# Altium schematic sheet Charge_station.SchDoc
size 594 x 420 mm; SheetNumber: 1; SheetTotal: 1
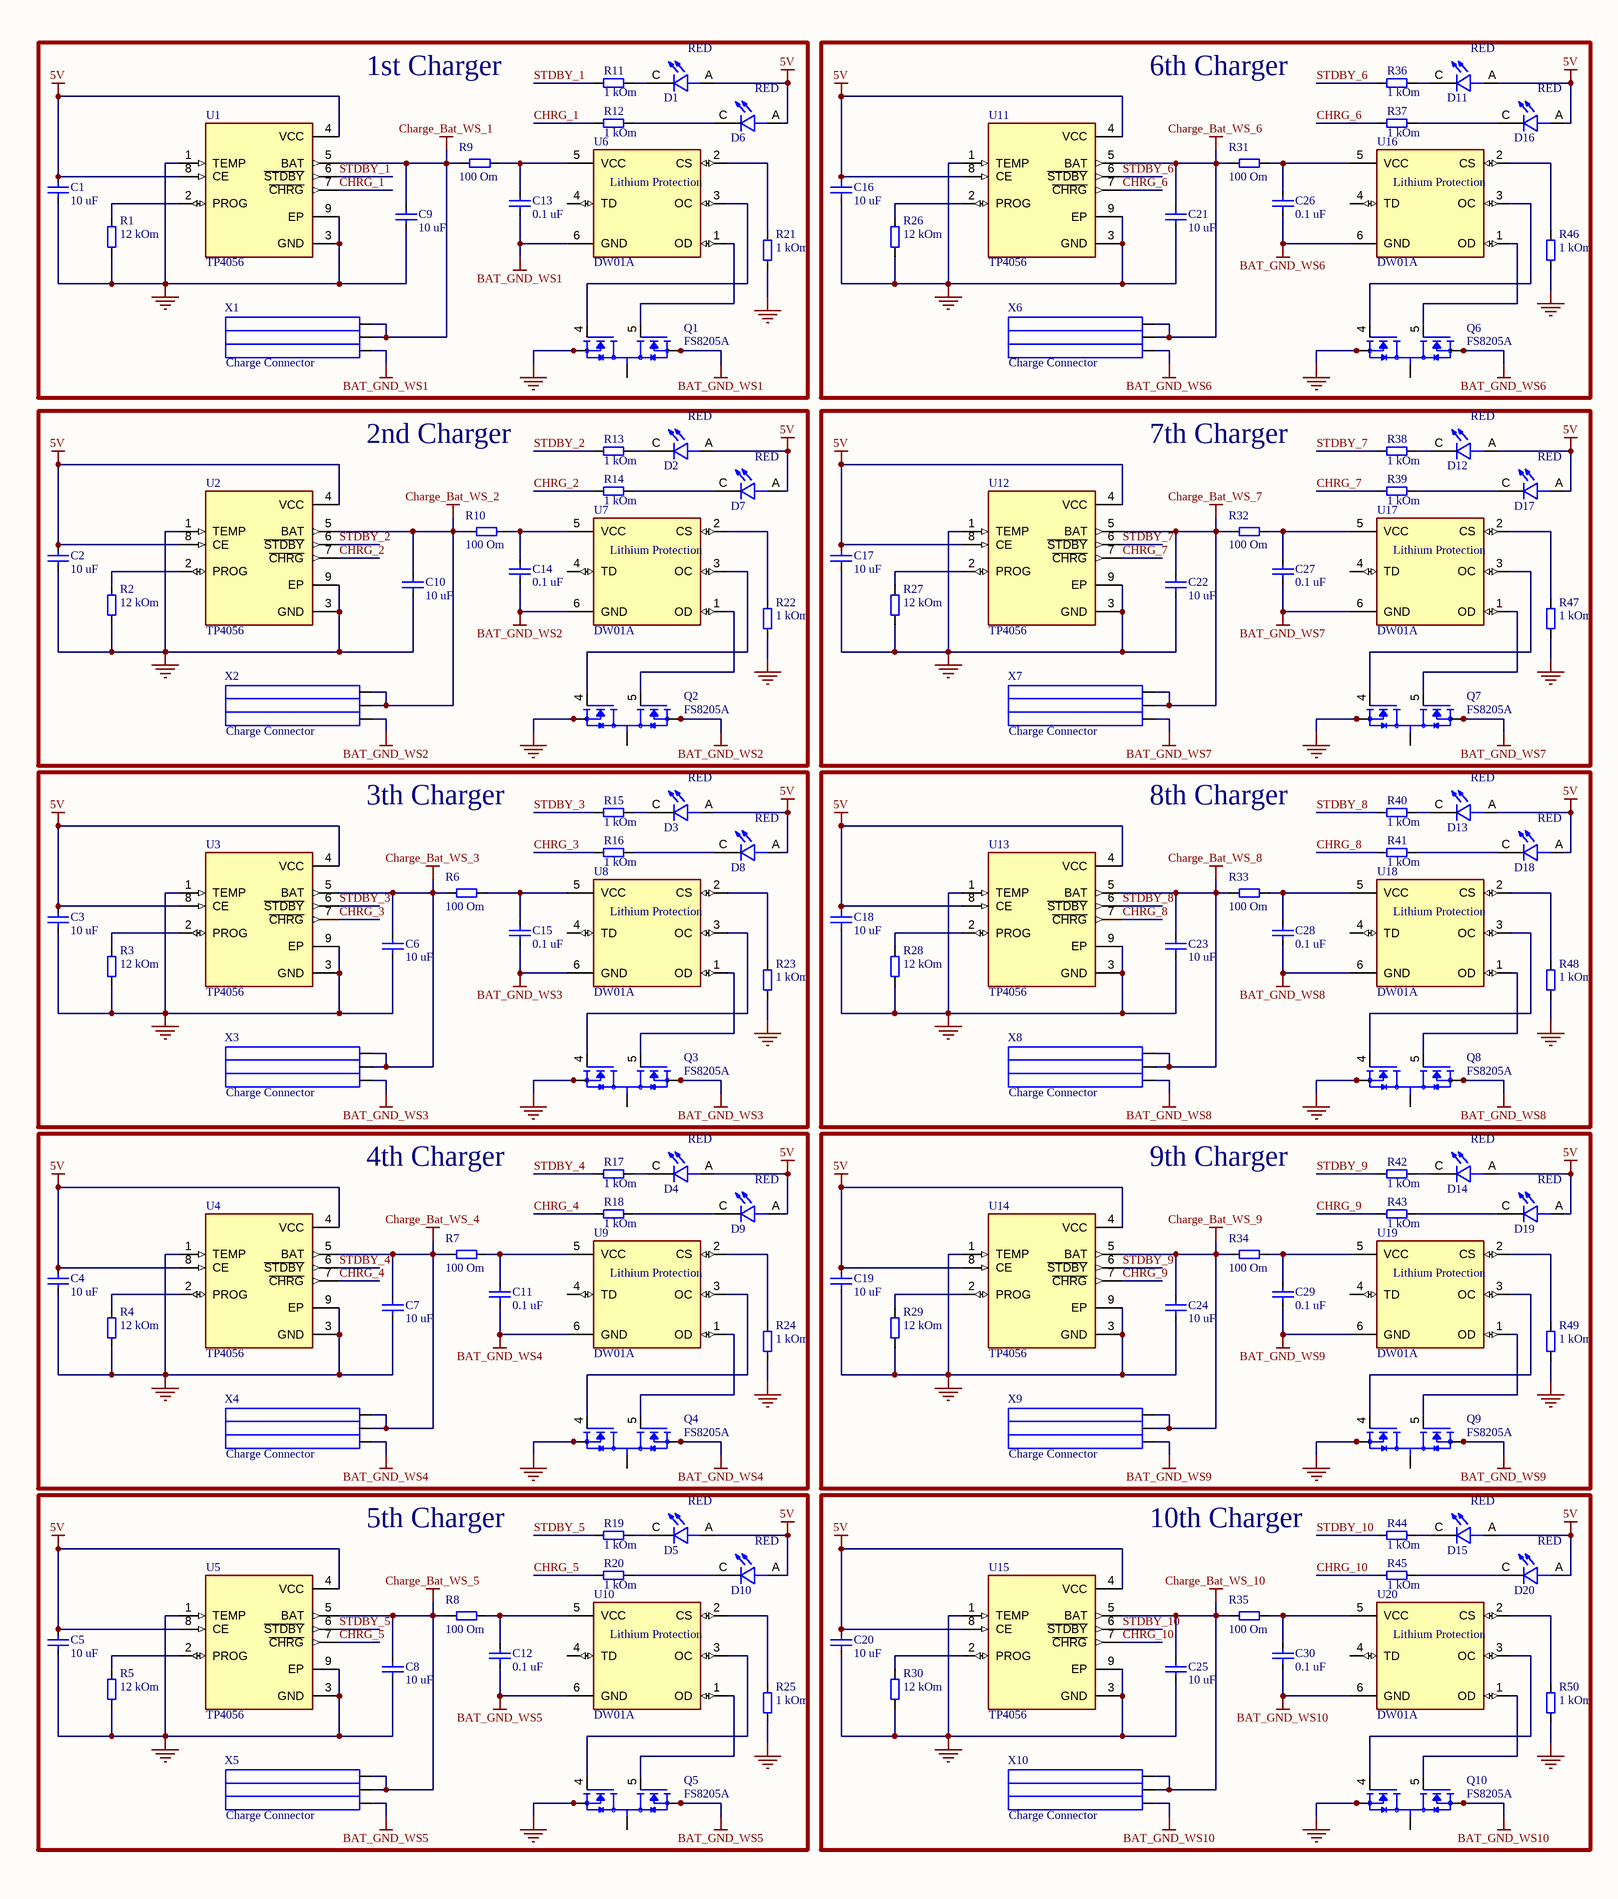
[diagram p0: Charge_station.SchDoc, left]
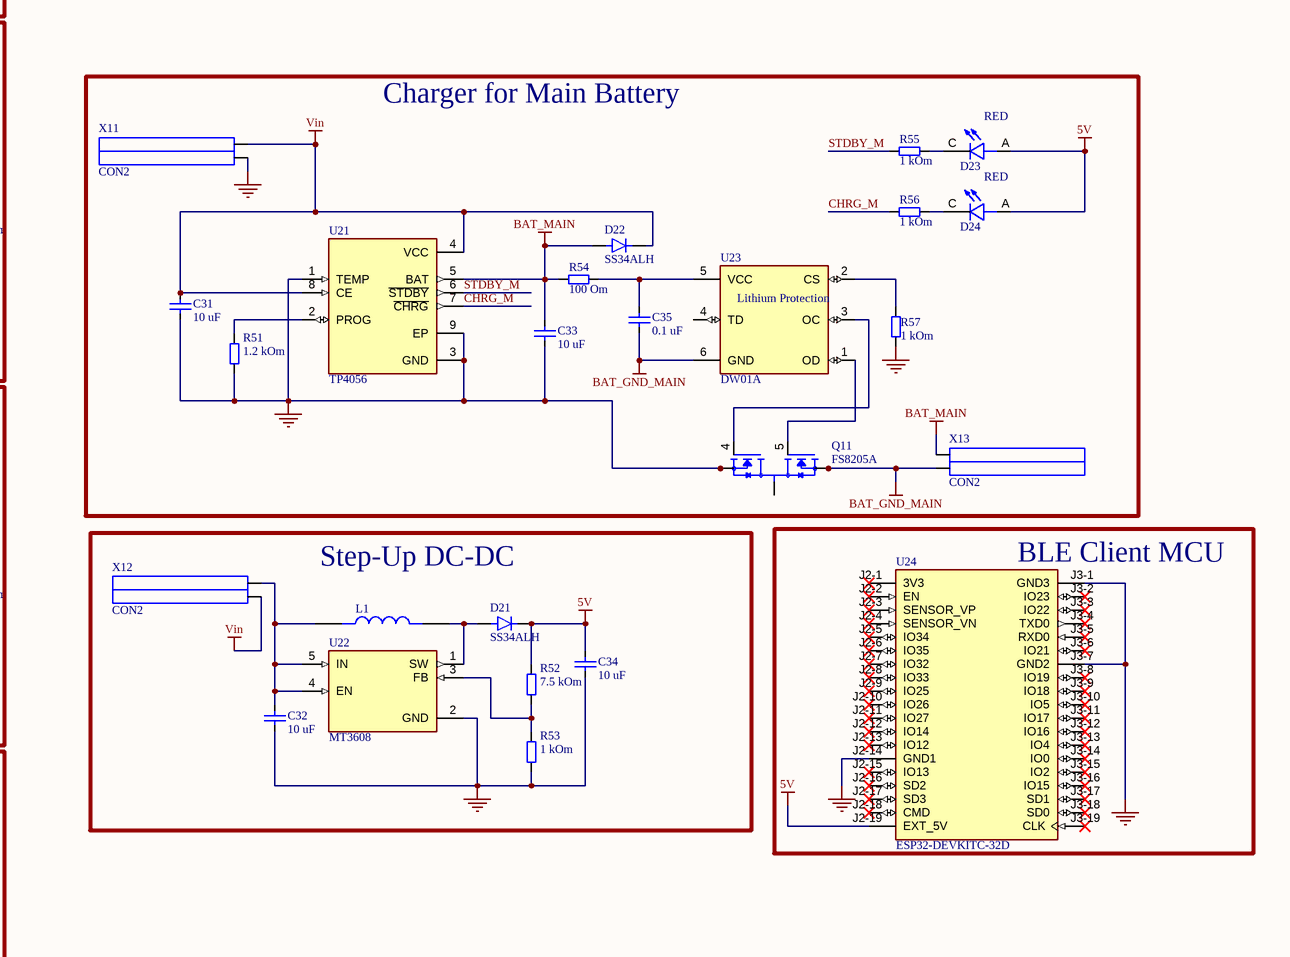
[diagram p1: Charge_station.SchDoc, right]

## Parts
C1  value 10 uF  [CAPC1608X90N]  (hidden comment: STD_CAP)
C2  value 10 uF  [CAPC1608X90N]  (hidden comment: STD_CAP)
C3  value 10 uF  [CAPC1608X90N]  (hidden comment: STD_CAP)
C4  value 10 uF  [CAPC1608X90N]  (hidden comment: STD_CAP)
C5  value 10 uF  [CAPC1608X90N]  (hidden comment: STD_CAP)
C6  value 10 uF  [CAPC1608X90N]  (hidden comment: STD_CAP)
C7  value 10 uF  [CAPC1608X90N]  (hidden comment: STD_CAP)
C8  value 10 uF  [CAPC1608X90N]  (hidden comment: STD_CAP)
C9  value 10 uF  [CAPC1608X90N]  (hidden comment: STD_CAP)
C10  value 10 uF  [CAPC1608X90N]  (hidden comment: STD_CAP)
C11  value 0.1 uF  [CAPC1608X90N]  (hidden comment: STD_CAP)
C12  value 0.1 uF  [CAPC1608X90N]  (hidden comment: STD_CAP)
C13  value 0.1 uF  [CAPC1608X90N]  (hidden comment: STD_CAP)
C14  value 0.1 uF  [CAPC1608X90N]  (hidden comment: STD_CAP)
C15  value 0.1 uF  [CAPC1608X90N]  (hidden comment: STD_CAP)
C16  value 10 uF  [CAPC1608X90N]  (hidden comment: STD_CAP)
C17  value 10 uF  [CAPC1608X90N]  (hidden comment: STD_CAP)
C18  value 10 uF  [CAPC1608X90N]  (hidden comment: STD_CAP)
C19  value 10 uF  [CAPC1608X90N]  (hidden comment: STD_CAP)
C20  value 10 uF  [CAPC1608X90N]  (hidden comment: STD_CAP)
C21  value 10 uF  [CAPC1608X90N]  (hidden comment: STD_CAP)
C22  value 10 uF  [CAPC1608X90N]  (hidden comment: STD_CAP)
C23  value 10 uF  [CAPC1608X90N]  (hidden comment: STD_CAP)
C24  value 10 uF  [CAPC1608X90N]  (hidden comment: STD_CAP)
C25  value 10 uF  [CAPC1608X90N]  (hidden comment: STD_CAP)
C26  value 0.1 uF  [CAPC1608X90N]  (hidden comment: STD_CAP)
C27  value 0.1 uF  [CAPC1608X90N]  (hidden comment: STD_CAP)
C28  value 0.1 uF  [CAPC1608X90N]  (hidden comment: STD_CAP)
C29  value 0.1 uF  [CAPC1608X90N]  (hidden comment: STD_CAP)
C30  value 0.1 uF  [CAPC1608X90N]  (hidden comment: STD_CAP)
C31  value 10 uF  [CAPC1608X90N]  (hidden comment: STD_CAP)
C32  value 10 uF  [CAPC2012X120N]  (hidden comment: STD_CAP)
C33  value 10 uF  [CAPC1608X90N]  (hidden comment: STD_CAP)
C34  value 10 uF  [CAPC2012X120N]  (hidden comment: STD_CAP)
C35  value 0.1 uF  [CAPC1608X90N]  (hidden comment: STD_CAP)
D1  7012X1  [LED_KPT-1608ZGC]  (value not drawn)
D2  7012X1  [LED_KPT-1608ZGC]  (value not drawn)
D3  7012X1  [LED_KPT-1608ZGC]  (value not drawn)
D4  7012X1  [LED_KPT-1608ZGC]  (value not drawn)
D5  7012X1  [LED_KPT-1608ZGC]  (value not drawn)
D6  7012X1  [LED_KPT-1608ZGC]  (value not drawn)
D7  7012X1  [LED_KPT-1608ZGC]  (value not drawn)
D8  7012X1  [LED_KPT-1608ZGC]  (value not drawn)
D9  7012X1  [LED_KPT-1608ZGC]  (value not drawn)
D10  7012X1  [LED_KPT-1608ZGC]  (value not drawn)
D11  7012X1  [LED_KPT-1608ZGC]  (value not drawn)
D12  7012X1  [LED_KPT-1608ZGC]  (value not drawn)
D13  7012X1  [LED_KPT-1608ZGC]  (value not drawn)
D14  7012X1  [LED_KPT-1608ZGC]  (value not drawn)
D15  7012X1  [LED_KPT-1608ZGC]  (value not drawn)
D16  7012X1  [LED_KPT-1608ZGC]  (value not drawn)
D17  7012X1  [LED_KPT-1608ZGC]  (value not drawn)
D18  7012X1  [LED_KPT-1608ZGC]  (value not drawn)
D19  7012X1  [LED_KPT-1608ZGC]  (value not drawn)
D20  7012X1  [LED_KPT-1608ZGC]  (value not drawn)
D21  SS34ALH  [SODFL5226X100N]
D22  SS34ALH  [SODFL5226X100N]
D23  7012X1  [LED_KPT-1608ZGC]  (value not drawn)
D24  7012X1  [LED_KPT-1608ZGC]  (value not drawn)
L1  B82464G4223M000  [IND_B82464G4223M000]  (value not drawn)
Q1  FS8205A  [SOP65P640X120-8N]
Q2  FS8205A  [SOP65P640X120-8N]
Q3  FS8205A  [SOP65P640X120-8N]
Q4  FS8205A  [SOP65P640X120-8N]
Q5  FS8205A  [SOP65P640X120-8N]
Q6  FS8205A  [SOP65P640X120-8N]
Q7  FS8205A  [SOP65P640X120-8N]
Q8  FS8205A  [SOP65P640X120-8N]
Q9  FS8205A  [SOP65P640X120-8N]
Q10  FS8205A  [SOP65P640X120-8N]
Q11  FS8205A  [SOP65P640X120-8N]
R1  value 12 kOm  [RESC1608X50AN]  (hidden comment: STD_RES)
R2  value 12 kOm  [RESC1608X50AN]  (hidden comment: STD_RES)
R3  value 12 kOm  [RESC1608X50AN]  (hidden comment: STD_RES)
R4  value 12 kOm  [RESC1608X50AN]  (hidden comment: STD_RES)
R5  value 12 kOm  [RESC1608X50AN]  (hidden comment: STD_RES)
R6  value 100 Om  [RESC1608X50AN]  (hidden comment: STD_RES)
R7  value 100 Om  [RESC1608X50AN]  (hidden comment: STD_RES)
R8  value 100 Om  [RESC1608X50AN]  (hidden comment: STD_RES)
R9  value 100 Om  [RESC1608X50AN]  (hidden comment: STD_RES)
R10  value 100 Om  [RESC1608X50AN]  (hidden comment: STD_RES)
R11  value 1 kOm  [R0603]  (hidden comment: STD_RES)
R12  value 1 kOm  [R0603]  (hidden comment: STD_RES)
R13  value 1 kOm  [R0603]  (hidden comment: STD_RES)
R14  value 1 kOm  [R0603]  (hidden comment: STD_RES)
R15  value 1 kOm  [R0603]  (hidden comment: STD_RES)
R16  value 1 kOm  [R0603]  (hidden comment: STD_RES)
R17  value 1 kOm  [R0603]  (hidden comment: STD_RES)
R18  value 1 kOm  [R0603]  (hidden comment: STD_RES)
R19  value 1 kOm  [R0603]  (hidden comment: STD_RES)
R20  value 1 kOm  [R0603]  (hidden comment: STD_RES)
R21  value 1 kOm  [RESC1608X50AN]  (hidden comment: STD_RES)
R22  value 1 kOm  [RESC1608X50AN]  (hidden comment: STD_RES)
R23  value 1 kOm  [RESC1608X50AN]  (hidden comment: STD_RES)
R24  value 1 kOm  [RESC1608X50AN]  (hidden comment: STD_RES)
R25  value 1 kOm  [RESC1608X50AN]  (hidden comment: STD_RES)
R26  value 12 kOm  [RESC1608X50AN]  (hidden comment: STD_RES)
R27  value 12 kOm  [RESC1608X50AN]  (hidden comment: STD_RES)
R28  value 12 kOm  [RESC1608X50AN]  (hidden comment: STD_RES)
R29  value 12 kOm  [RESC1608X50AN]  (hidden comment: STD_RES)
R30  value 12 kOm  [RESC1608X50AN]  (hidden comment: STD_RES)
R31  value 100 Om  [RESC1608X50AN]  (hidden comment: STD_RES)
R32  value 100 Om  [RESC1608X50AN]  (hidden comment: STD_RES)
R33  value 100 Om  [RESC1608X50AN]  (hidden comment: STD_RES)
R34  value 100 Om  [RESC1608X50AN]  (hidden comment: STD_RES)
R35  value 100 Om  [RESC1608X50AN]  (hidden comment: STD_RES)
R36  value 1 kOm  [R0603]  (hidden comment: STD_RES)
R37  value 1 kOm  [R0603]  (hidden comment: STD_RES)
R38  value 1 kOm  [R0603]  (hidden comment: STD_RES)
R39  value 1 kOm  [R0603]  (hidden comment: STD_RES)
R40  value 1 kOm  [R0603]  (hidden comment: STD_RES)
R41  value 1 kOm  [R0603]  (hidden comment: STD_RES)
R42  value 1 kOm  [R0603]  (hidden comment: STD_RES)
R43  value 1 kOm  [R0603]  (hidden comment: STD_RES)
R44  value 1 kOm  [R0603]  (hidden comment: STD_RES)
R45  value 1 kOm  [R0603]  (hidden comment: STD_RES)
R46  value 1 kOm  [RESC1608X50AN]  (hidden comment: STD_RES)
R47  value 1 kOm  [RESC1608X50AN]  (hidden comment: STD_RES)
R48  value 1 kOm  [RESC1608X50AN]  (hidden comment: STD_RES)
R49  value 1 kOm  [RESC1608X50AN]  (hidden comment: STD_RES)
R50  value 1 kOm  [RESC1608X50AN]  (hidden comment: STD_RES)
R51  value 1.2 kOm  [RESC1608X50AN]  (hidden comment: STD_RES)
R52  value 7.5 kOm  [RESC1608X50AN]  (hidden comment: STD_RES)
R53  value 1 kOm  [RESC1608X50AN]  (hidden comment: STD_RES)
R54  value 100 Om  [RESC1608X50AN]  (hidden comment: STD_RES)
R55  value 1 kOm  [R0603]  (hidden comment: STD_RES)
R56  value 1 kOm  [R0603]  (hidden comment: STD_RES)
R57  value 1 kOm  [RESC1608X50AN]  (hidden comment: STD_RES)
U1  TP4056  [SOP127P600X175-9N]
U2  TP4056  [SOP127P600X175-9N]
U3  TP4056  [SOP127P600X175-9N]
U4  TP4056  [SOP127P600X175-9N]
U5  TP4056  [SOP127P600X175-9N]
U6  DW01A  [SOT23-6]
U7  DW01A  [SOT23-6]
U8  DW01A  [SOT23-6]
U9  DW01A  [SOT23-6]
U10  DW01A  [SOT23-6]
U11  TP4056  [SOP127P600X175-9N]
U12  TP4056  [SOP127P600X175-9N]
U13  TP4056  [SOP127P600X175-9N]
U14  TP4056  [SOP127P600X175-9N]
U15  TP4056  [SOP127P600X175-9N]
U16  DW01A  [SOT23-6]
U17  DW01A  [SOT23-6]
U18  DW01A  [SOT23-6]
U19  DW01A  [SOT23-6]
U20  DW01A  [SOT23-6]
U21  TP4056  [SOP127P600X175-9N]
U22  MT3608  [SOT95P280X145-6N]
U23  DW01A  [SOT23-6]
U24  ESP32-DEVKITC-32D  [MODULE_ESP32-DEVKITC-32D]
X1  Charge Connector  [POGO PINS]
X2  Charge Connector  [POGO PINS]
X3  Charge Connector  [POGO PINS]
X4  Charge Connector  [POGO PINS]
X5  Charge Connector  [POGO PINS]
X6  Charge Connector  [POGO PINS]
X7  Charge Connector  [POGO PINS]
X8  Charge Connector  [POGO PINS]
X9  Charge Connector  [POGO PINS]
X10  Charge Connector  [POGO PINS]
X11  CON2  [CON4_bat]
X12  CON2  [CON4_bat]
X13  CON2  [CON4_bat]

## Blocks framed on the sheet
1st Charger: C1 C9 C13 D1 D6 Q1 R1 R9 R11 R12 R21 U1 U6 X1
6th Charger: C16 C21 C26 D11 D16 Q6 R26 R31 R36 R37 R46 U11 U16 X6
2nd Charger: C2 C10 C14 D2 D7 Q2 R2 R10 R13 R14 R22 U2 U7 X2
7th Charger: C17 C22 C27 D12 D17 Q7 R27 R32 R38 R39 R47 U12 U17 X7
3th Charger: C3 C6 C15 D3 D8 Q3 R3 R6 R15 R16 R23 U3 U8 X3
8th Charger: C18 C23 C28 D13 D18 Q8 R28 R33 R40 R41 R48 U13 U18 X8
Charger for Main Battery: C31 C33 C35 D22-D24 Q11 R51 R54-R57 U21 U23 X11 X13
4th Charger: C4 C7 C11 D4 D9 Q4 R4 R7 R17 R18 R24 U4 U9 X4
9th Charger: C19 C24 C29 D14 D19 Q9 R29 R34 R42 R43 R49 U14 U19 X9
Step-Up DC-DC: C32 C34 D21 L1 R52 R53 U22 X12
BLE Client MCU: U24
5th Charger: C5 C8 C12 D5 D10 Q5 R5 R8 R19 R20 R25 U5 U10 X5
10th Charger: C20 C25 C30 D15 D20 Q10 R30 R35 R44 R45 R50 U15 U20 X10

## Nets
5V: C1.2 C2.2 C3.2 C4.2 C5.2 C16.2 C17.2 C18.2 C19.2 C20.2 C34.2 D1.A D2.A D3.A D4.A D5.A D6.A D7.A D8.A D9.A D10.A D11.A D12.A D13.A D14.A D15.A D16.A D17.A D18.A D19.A D20.A D21.1(K) D23.A D24.A R52.2 U1.4(VCC) U1.8(CE) U2.4(VCC) U2.8(CE) U3.4(VCC) U3.8(CE) U4.4(VCC) U4.8(CE) U5.4(VCC) U5.8(CE) U11.4(VCC) U11.8(CE) U12.4(VCC) U12.8(CE) U13.4(VCC) U13.8(CE) U14.4(VCC) U14.8(CE) U15.4(VCC) U15.8(CE) U24.J2-19(EXT_5V)
BAT_GND_MAIN: C35.1 Q11.6(S2) Q11.7(S2) U23.6(GND) X13.2
BAT_GND_WS1: C13.1 Q1.6(S2) Q1.7(S2) U6.6(GND) X1.3
BAT_GND_WS2: C14.1 Q2.6(S2) Q2.7(S2) U7.6(GND) X2.3
BAT_GND_WS3: C15.1 Q3.6(S2) Q3.7(S2) U8.6(GND) X3.3
BAT_GND_WS4: C11.1 Q4.6(S2) Q4.7(S2) U9.6(GND) X4.3
BAT_GND_WS5: C12.1 Q5.6(S2) Q5.7(S2) U10.6(GND) X5.3
BAT_GND_WS6: C26.1 Q6.6(S2) Q6.7(S2) U16.6(GND) X6.3
BAT_GND_WS7: C27.1 Q7.6(S2) Q7.7(S2) U17.6(GND) X7.3
BAT_GND_WS8: C28.1 Q8.6(S2) Q8.7(S2) U18.6(GND) X8.3
BAT_GND_WS9: C29.1 Q9.6(S2) Q9.7(S2) U19.6(GND) X9.3
BAT_GND_WS10: C30.1 Q10.6(S2) Q10.7(S2) U20.6(GND) X10.3
BAT_MAIN: C33.2 D22.2(A) R54.2 U21.5(BAT) X13.1
Charge_Bat_WS_1: C9.2 R9.2 U1.5(BAT) X1.1 X1.2
Charge_Bat_WS_2: C10.2 R10.2 U2.5(BAT) X2.1 X2.2
Charge_Bat_WS_3: C6.2 R6.2 U3.5(BAT) X3.1 X3.2
Charge_Bat_WS_4: C7.2 R7.2 U4.5(BAT) X4.1 X4.2
Charge_Bat_WS_5: C8.2 R8.2 U5.5(BAT) X5.1 X5.2
Charge_Bat_WS_6: C21.2 R31.2 U11.5(BAT) X6.1 X6.2
Charge_Bat_WS_7: C22.2 R32.2 U12.5(BAT) X7.1 X7.2
Charge_Bat_WS_8: C23.2 R33.2 U13.5(BAT) X8.1 X8.2
Charge_Bat_WS_9: C24.2 R34.2 U14.5(BAT) X9.1 X9.2
Charge_Bat_WS_10: C25.2 R35.2 U15.5(BAT) X10.1 X10.2
GND: C1.1 C2.1 C3.1 C4.1 C5.1 C6.1 C7.1 C8.1 C9.1 C10.1 C16.1 C17.1 C18.1 C19.1 C20.1 C21.1 C22.1 C23.1 C24.1 C25.1 C31.1 C32.1 C33.1 C34.1 Q1.2(S1) Q1.3(S1) Q2.2(S1) Q2.3(S1) Q3.2(S1) Q3.3(S1) Q4.2(S1) Q4.3(S1) Q5.2(S1) Q5.3(S1) Q6.2(S1) Q6.3(S1) Q7.2(S1) Q7.3(S1) Q8.2(S1) Q8.3(S1) Q9.2(S1) Q9.3(S1) Q10.2(S1) Q10.3(S1) Q11.2(S1) Q11.3(S1) R1.1 R2.1 R3.1 R4.1 R5.1 R21.1 R22.1 R23.1 R24.1 R25.1 R26.1 R27.1 R28.1 R29.1 R30.1 R46.1 R47.1 R48.1 R49.1 R50.1 R51.1 R53.1 R57.1 U1.1(TEMP) U1.3(GND) U1.9(EP) U2.1(TEMP) U2.3(GND) U2.9(EP) U3.1(TEMP) U3.3(GND) U3.9(EP) U4.1(TEMP) U4.3(GND) U4.9(EP) U5.1(TEMP) U5.3(GND) U5.9(EP) U11.1(TEMP) U11.3(GND) U11.9(EP) U12.1(TEMP) U12.3(GND) U12.9(EP) U13.1(TEMP) U13.3(GND) U13.9(EP) U14.1(TEMP) U14.3(GND) U14.9(EP) U15.1(TEMP) U15.3(GND) U15.9(EP) U21.1(TEMP) U21.3(GND) U21.9(EP) U22.2(GND) U24.J2-14(GND1) U24.J3-1(GND3) U24.J3-7(GND2) X11.2
Vin: C31.2 D22.1(K) U21.4(VCC) U21.8(CE) X11.1 X12.2
CHRG_1: R12.1 U1.7(~{CHRG})
CHRG_2: R14.1 U2.7(~{CHRG})
CHRG_3: R16.1 U3.7(~{CHRG})
CHRG_4: R18.1 U4.7(~{CHRG})
CHRG_5: R20.1 U5.7(~{CHRG})
CHRG_6: R37.1 U11.7(~{CHRG})
CHRG_7: R39.1 U12.7(~{CHRG})
CHRG_8: R41.1 U13.7(~{CHRG})
CHRG_9: R43.1 U14.7(~{CHRG})
CHRG_10: R45.1 U15.7(~{CHRG})
CHRG_M: R56.1 U21.7(~{CHRG})
STDBY_1: R11.1 U1.6(~{STDBY})
STDBY_2: R13.1 U2.6(~{STDBY})
STDBY_3: R15.1 U3.6(~{STDBY})
STDBY_4: R17.1 U4.6(~{STDBY})
STDBY_5: R19.1 U5.6(~{STDBY})
STDBY_6: R36.1 U11.6(~{STDBY})
STDBY_7: R38.1 U12.6(~{STDBY})
STDBY_8: R40.1 U13.6(~{STDBY})
STDBY_9: R42.1 U14.6(~{STDBY})
STDBY_10: R44.1 U15.6(~{STDBY})
STDBY_M: R55.1 U21.6(~{STDBY})
NetC11_2: C11.2 R7.1 U9.5(VCC)
NetC12_2: C12.2 R8.1 U10.5(VCC)
NetC13_2: C13.2 R9.1 U6.5(VCC)
NetC14_2: C14.2 R10.1 U7.5(VCC)
NetC15_2: C15.2 R6.1 U8.5(VCC)
NetC26_2: C26.2 R31.1 U16.5(VCC)
NetC27_2: C27.2 R32.1 U17.5(VCC)
NetC28_2: C28.2 R33.1 U18.5(VCC)
NetC29_2: C29.2 R34.1 U19.5(VCC)
NetC30_2: C30.2 R35.1 U20.5(VCC)
NetC32_2: C32.2 L1.1 U22.4(EN) U22.5(IN) X12.1
NetC35_2: C35.2 R54.1 U23.5(VCC)
NetD1_C: D1.C R11.2
NetD2_C: D2.C R13.2
NetD3_C: D3.C R15.2
NetD4_C: D4.C R17.2
NetD5_C: D5.C R19.2
NetD6_C: D6.C R12.2
NetD7_C: D7.C R14.2
NetD8_C: D8.C R16.2
NetD9_C: D9.C R18.2
NetD10_C: D10.C R20.2
NetD11_C: D11.C R36.2
NetD12_C: D12.C R38.2
NetD13_C: D13.C R40.2
NetD14_C: D14.C R42.2
NetD15_C: D15.C R44.2
NetD16_C: D16.C R37.2
NetD17_C: D17.C R39.2
NetD18_C: D18.C R41.2
NetD19_C: D19.C R43.2
NetD20_C: D20.C R45.2
NetD21_2: D21.2(A) L1.2 U22.1(SW)
NetD23_C: D23.C R55.2
NetD24_C: D24.C R56.2
NetQ1_1: Q1.1(D12) Q1.8(D12)
NetQ1_4: Q1.4(G1) U6.3(OC)
NetQ1_5: Q1.5(G2) U6.1(OD)
NetQ2_1: Q2.1(D12) Q2.8(D12)
NetQ2_4: Q2.4(G1) U7.3(OC)
NetQ2_5: Q2.5(G2) U7.1(OD)
NetQ3_1: Q3.1(D12) Q3.8(D12)
NetQ3_4: Q3.4(G1) U8.3(OC)
NetQ3_5: Q3.5(G2) U8.1(OD)
NetQ4_1: Q4.1(D12) Q4.8(D12)
NetQ4_4: Q4.4(G1) U9.3(OC)
NetQ4_5: Q4.5(G2) U9.1(OD)
NetQ5_1: Q5.1(D12) Q5.8(D12)
NetQ5_4: Q5.4(G1) U10.3(OC)
NetQ5_5: Q5.5(G2) U10.1(OD)
NetQ6_1: Q6.1(D12) Q6.8(D12)
NetQ6_4: Q6.4(G1) U16.3(OC)
NetQ6_5: Q6.5(G2) U16.1(OD)
NetQ7_1: Q7.1(D12) Q7.8(D12)
NetQ7_4: Q7.4(G1) U17.3(OC)
NetQ7_5: Q7.5(G2) U17.1(OD)
NetQ8_1: Q8.1(D12) Q8.8(D12)
NetQ8_4: Q8.4(G1) U18.3(OC)
NetQ8_5: Q8.5(G2) U18.1(OD)
NetQ9_1: Q9.1(D12) Q9.8(D12)
NetQ9_4: Q9.4(G1) U19.3(OC)
NetQ9_5: Q9.5(G2) U19.1(OD)
NetQ10_1: Q10.1(D12) Q10.8(D12)
NetQ10_4: Q10.4(G1) U20.3(OC)
NetQ10_5: Q10.5(G2) U20.1(OD)
NetQ11_1: Q11.1(D12) Q11.8(D12)
NetQ11_4: Q11.4(G1) U23.3(OC)
NetQ11_5: Q11.5(G2) U23.1(OD)
NetR1_2: R1.2 U1.2(PROG)
NetR2_2: R2.2 U2.2(PROG)
NetR3_2: R3.2 U3.2(PROG)
NetR4_2: R4.2 U4.2(PROG)
NetR5_2: R5.2 U5.2(PROG)
NetR21_2: R21.2 U6.2(CS)
NetR22_2: R22.2 U7.2(CS)
NetR23_2: R23.2 U8.2(CS)
NetR24_2: R24.2 U9.2(CS)
NetR25_2: R25.2 U10.2(CS)
NetR26_2: R26.2 U11.2(PROG)
NetR27_2: R27.2 U12.2(PROG)
NetR28_2: R28.2 U13.2(PROG)
NetR29_2: R29.2 U14.2(PROG)
NetR30_2: R30.2 U15.2(PROG)
NetR46_2: R46.2 U16.2(CS)
NetR47_2: R47.2 U17.2(CS)
NetR48_2: R48.2 U18.2(CS)
NetR49_2: R49.2 U19.2(CS)
NetR50_2: R50.2 U20.2(CS)
NetR51_2: R51.2 U21.2(PROG)
NetR52_1: R52.1 R53.2 U22.3(FB)
NetR57_2: R57.2 U23.2(CS)

Not connected (* = marked no-connect by the designer): U6 4(TD); U7 4(TD); U8 4(TD); U9 4(TD); U10 4(TD); U16 4(TD); U17 4(TD); U18 4(TD); U19 4(TD); U20 4(TD); U23 4(TD); U24 J2-1(3V3)* J2-2(EN)* J2-3(SENSOR_VP)* J2-4(SENSOR_VN)* J2-5(IO34)* J2-6(IO35)* J2-7(IO32)* J2-8(IO33)* J2-9(IO25)* J2-10(IO26)* J2-11(IO27)* J2-12(IO14)* J2-13(IO12)* J2-15(IO13)* J2-16(SD2)* J2-17(SD3)* J2-18(CMD)* J3-2(IO23)* J3-3(IO22)* J3-4(TXD0)* J3-5(RXD0)* J3-6(IO21)* J3-8(IO19)* J3-9(IO18)* J3-10(IO5)* J3-11(IO17)* J3-12(IO16)* J3-13(IO4)* J3-14(IO0)* J3-15(IO2)* J3-16(IO15)* J3-17(SD1)* J3-18(SD0)* J3-19(CLK)*

## Notes on the sheet
- DWG NO:
- REV:
- THIS DOCUMENT AND THE DATA DISCLOSED HEREIN OR
- HEREWITH IS THE PROPERTY OF ALTIUM LIMITED AND MAY
- BE FREELY DISTRIBUTED IN WHOLE. NO RIGHTS ARE
- RESERVED OR EXPRESS OR IMPLIED WARANTEE GIVEN.
- REVISION
- DESCRIPTION
- DATE
- APPROVED
- ENG:
- APPROVALS
- PROJECT
- DSN:
- CHK:
- REFERENCE DOCUMENTS
- PROJECT REVISION:
- TITLE
- DOCUMENT REVISION:
- DESIGN ITEM:
- BOM:
- FAB DWG:
- PCB DWG:
- ASSY DWG:
- SCALE:
- A2
- SIZE
- CAGE CODE
- FILE NAME
- DWG NO.
- SHEET
- OF
- REV
- (in symbol 7012X1) RED
- (in symbol DW01A) Lithium Protection

## Library data of the parts
C1-C10 C16-C25 C31 C33 = 5414: ManufacturerPartnumber: GRM188R61C106MAAL; Manufacturer: muRata; Number_Base: 5414; Comp_ID: 200004-119; Lib_Description: Capacitor; Comp_Description: Capacitor 0603 10 uF ±20% 16V X5R; Human_Readable: Конденсатор 0603 10 uF ±20% 16V X5R; Precision: ±20%; Temp_Range: -55°C to +85°C; Voltage_Range: 16V; Comp_Class_Number: 200004; Comp_Class_Name: Capacitors Chip SMD 0603; AuthorCreation_Comp: altium_lib_sch_p; BOM: Конденсатор 0603 10 uF ±20% 16V X5R    GRM188R61C106MAAL muRata; Footprint_Description: Chip Capacitor EIA 0603. METRIC 1608, 2-Leads, Body 1,6x0,8mm, IPC Medium Density; HelpURL: \\corp1\RNDlibrary\_Library\Altium_lib\Datasheet\muRata\Chip_Monolithic_Ceramic_Capacitors\c02e.pdf; ComponentLink1Description: MANUFACTURER_URL; ComponentLink1URL: http://psearch.murata.com/capacitor/product/GRM188R60J226MEA0%23.html; Verified: N; Price: 0,0599999986588955; TimeCreation_Comp: 18.05.2016 16:00:24; AuthorModification_Comp: altium_lib_sch_p; TimeModification_Comp: 18.05.2016 16:13:18
C11-C15 C26-C30 C35 = 6202: ManufacturerPartnumber: C1608X7R1H104K; Manufacturer: TDK; Number_Base: 6202; Comp_ID: 200004-122; Lib_Description: Capacitor; Comp_Description: Capacitors 0603 0.1 uF ±10% 50V X7R; Precision: ± 10%; Temp_Range: -55°C to +125°C; Voltage_Range: 50 V; Dielectric: X7R; Comp_Class_Number: 200004; Comp_Class_Name: Capacitors Chip SMD 0603; AuthorCreation_Comp: anosova; BOM: Capacitors 0603 0.1 uF ±10% 50V X7R    C1608X7R1H104K TDK; Footprint_Description: Chip Capacitor EIA 0603. METRIC 1608, 2-Leads, Body 1,60x0,8mm, IPC Medium Density; Human_Readable: Capacitors 0603 0.1 uF ±10% 50V X7R; HelpURL: \\corp1\RNDlibrary\_Library\Altium_lib\Datasheet\TDK\Ceramic_Capacitors_C-Series\cseries.pdf; ComponentLink1Description: MANUFACTURER_URL; ComponentLink1URL: https://media.digikey.com/pdf/Data%20Sheets/TDK%20PDFs/C_Series_GeneralAppl_B11.pdf; Verified: N; TimeCreation_Comp: 29.10.2021 11:15:01; AuthorModification_Comp: anosova; TimeModification_Comp: 29.10.2021 11:29:43
C32 C34 = 4014: ManufacturerPartnumber: GRM21BR71A106KE51L; Manufacturer: muRata; Number_Base: 4014; Comp_ID: 200005-0069; Lib_Description: Capacitor; Comp_Description: Capacitors 0805 10 uF ±10% 10V X7R; Human_Readable: Конденсатор 0805 10 uF ±10% 10V X7R; Precision: ±10%; Temp_Range: -55 to 125°C; Voltage_Range: 10V; Dielectric: X7R; Comp_Class_Number: 200005; Comp_Class_Name: Capacitors Chip SMD 0805; BOM: Конденсатор 0805 10 uF ±10% 10V X7R    GRM21BR71A106KE51L muRata; Footprint_Description: Chip Capacitor EIA 0805. METRIC 2012, 2-Leads, Body 2,0x1,2mm, IPC Medium Density; HelpURL: \\corp1\RNDlibrary\_Library\Altium_lib\Datasheet\muRata\Chip_Monolithic_Ceramic_Capacitors\Chip_Monolithic_Ceramic_Capacitors.pdf; ComponentLink1Description: MANUFACTURER_URL; ComponentLink1URL: http://www.murata.com/products/catalog/pdf/c02e.pdf; TimeModification_Comp: 07.12.2011 12:55:51
D1-D20 D23 D24 = 7012X1: Red - LED Indication - Discrete 1.7V 0805 (2012 Metric); MF: VCC; Package: 0805 Visual Communications; Purchase-URL: https://pricing.snapeda.com/search/part/7012X1/?ref=eda; MP: 7012X1; Value: *; Availability: In Stock; SnapEDA_Link: https://www.snapeda.com/parts/7012X1/Visual+Communications/view-part/?ref=snap; Price: None; Check_prices: https://www.snapeda.com/parts/7012X1/Visual+Communications/view-part/?ref=eda
D21 D22 = SS34ALH: 3A, 40V, Schottky Rectifier; MF: Taiwan Semiconductor; Package: DO-221AC Taiwan Semiconductor; MP: SS34ALH; Value: *; SnapEDA_Link: https://www.snapeda.com/parts/SS34ALH/Taiwan+Semiconductor/view-part/?ref=snap; Availability: Not in stock; Price: None; Check_prices: https://www.snapeda.com/parts/SS34ALH/Taiwan+Semiconductor/view-part/?ref=eda
L1 = B82464G4223M000: MF: TDK ELECTRONICS; Value: *; SnapEDA_Link: https://www.snapeda.com/parts/B82464G4223M000/TM+Electronics/view-part/?ref=snap; MP: B82464G4223M000; Package: None; Check_prices: https://www.snapeda.com/parts/B82464G4223M000/TM+Electronics/view-part/?ref=eda; Purchase-URL: https://pricing.snapeda.com/search/part/B82464G4223M000/?ref=eda
Q1-Q11 = FS8205A: N/A; MF: Fortune Semiconductor; SnapEDA_Link: https://www.snapeda.com/parts/FS8205A/Fortune+Semiconductor/view-part/?ref=snap; Package: Package; MP: FS8205A; Check_prices: https://www.snapeda.com/parts/FS8205A/Fortune+Semiconductor/view-part/?ref=eda; Price: None; Value: *; Availability: Not in stock
R1-R5 R26-R30 = 99: ManufacturerPartnumber: RC0603JR-0712KL; Manufacturer: Yageo; Number_Base: 99; Comp_ID: 10000403-099; Lib_Description: Resistor; Comp_Description: Resistor 0603 5% E24 12 kOm; Human_Readable: Резистор 0603 5% E24 12 кОм; Precision: 5%; Temp_Range: -55 °C to +155 °C; Power_Range: 0.1W; Comp_Class_Number: 10000403; Comp_Class_Name: Resistors Chip SMD 0603 5% E24; BOM: Резистор 0603 5% E24 12 кОм    RC0603JR-0712KL Yageo; Footprint_Description: Chip Resistor EIA 0603. METRIC 1608, 2-Leads, Body 1,6x0,8mm, IPC Medium Density; HelpURL: \\CORP1\RNDlibrary\_Library\Altium_lib\Datasheet\Yageo\RC0603\PYu-RC0603_51_RoHS_L_4.pdf; ComponentLink1Description: MANUFACTURER_URL; ComponentLink1URL: http://www.yageo.com/documents/recent/PYu-RC0603_51_RoHS_L_4.pdf; Verified: N; Price: 0,00600000005215406; TimeModification_Comp: 06.12.2011 13:32:14
R6-R10 R31-R35 R54 = 362: ManufacturerPartnumber: RC0603FR-07100RL; Manufacturer: Yageo; Number_Base: 362; Comp_ID: 1041-193; Lib_Description: Resistor; Comp_Description: Resistor 0603 1% E96 100 Om; Human_Readable: Резистор 0603 1% E96 100 Ом; Precision: 1%; Temp_Range: -55 °C to +155 °C; Power_Range: 0.1W; Comp_Class_Number: 10000401; Comp_Class_Name: Resistors Chip SMD 0603 1% E96; BOM: Резистор 0603 1% E96 100 Ом    RC0603FR-07100RL Yageo; Footprint_Description: Chip Resistor EIA 0603. METRIC 1608, 2-Leads, Body 1,6x0,8mm, IPC Medium Density; HelpURL: \\CORP1\RNDlibrary\_Library\Altium_lib\Datasheet\Yageo\RC0603\PYu-RC0603_51_RoHS_L_4.pdf; ComponentLink1Description: MANUFACTURER_URL; ComponentLink1URL: http://www.yageo.com/documents/recent/PYu-RC0603_51_RoHS_L_4.pdf; Price: 0,00600000005215406; TimeModification_Comp: 09.12.2011 8:18:43
R11-R25 R36-R50 R53 R55-R57 = 458: ManufacturerPartnumber: RC0603FR-071K00L; Manufacturer: Yageo; Number_Base: 458; Comp_ID: 1041-289; Lib_Description: Resistor; Comp_Description: Resistor 0603 1% E96 1 kOm; Human_Readable: Резистор 0603 1% E96 1 кОм; Precision: 1%; Temp_Range: -55 °C to +155 °C; Power_Range: 0.1W; Comp_Class_Number: 10000401; Comp_Class_Name: Resistors Chip SMD 0603 1% E96; BOM: Резистор 0603 1% E96 1 кОм    RC0603FR-071K00L Yageo; Footprint_Description: Chip Resistor EIA 0603. METRIC 1608, 2-Leads, Body 1,6x0,8mm, IPC Medium Density; HelpURL: \\CORP1\RNDlibrary\_Library\Altium_lib\Datasheet\Yageo\RC0603\PYu-RC0603_51_RoHS_L_4.pdf; ComponentLink1Description: MANUFACTURER_URL; ComponentLink1URL: http://www.yageo.com/documents/recent/PYu-RC0603_51_RoHS_L_4.pdf; Price: 0,00600000005215406; TimeModification_Comp: 09.12.2011 8:18:44
R51 = 75: ManufacturerPartnumber: RC0603JR-071K2L; Manufacturer: Yageo; Number_Base: 75; Comp_ID: 10000403-075; Lib_Description: Resistor; Comp_Description: Resistor 0603 5% E24 1.2 kOm; Human_Readable: Резистор 0603 5% E24 1,2 кОм; Precision: 5%; Temp_Range: -55 °C to +155 °C; Power_Range: 0.1W; Comp_Class_Number: 10000403; Comp_Class_Name: Resistors Chip SMD 0603 5% E24; BOM: Резистор 0603 5% E24 1,2 кОм    RC0603JR-071K2L Yageo; Footprint_Description: Chip Resistor EIA 0603. METRIC 1608, 2-Leads, Body 1,6x0,8mm, IPC Medium Density; HelpURL: \\CORP1\RNDlibrary\_Library\Altium_lib\Datasheet\Yageo\RC0603\PYu-RC0603_51_RoHS_L_4.pdf; ComponentLink1Description: MANUFACTURER_URL; ComponentLink1URL: http://www.yageo.com/documents/recent/PYu-RC0603_51_RoHS_L_4.pdf; Verified: N; Price: 0,00600000005215406; TimeModification_Comp: 06.12.2011 13:32:14
R52 = 542: ManufacturerPartnumber: RC0603FR-077K50L; Manufacturer: Yageo; Number_Base: 542; Comp_ID: 1041-373; Lib_Description: Resistor; Comp_Description: Resistor 0603 1% E96 7.5 kOm; Human_Readable: Резистор 0603 1% E96 7,5 кОм; Precision: 1%; Temp_Range: -55 °C to +155 °C; Power_Range: 0.1W; Comp_Class_Number: 10000401; Comp_Class_Name: Resistors Chip SMD 0603 1% E96; BOM: Резистор 0603 1% E96 7,5 кОм    RC0603FR-077K50L Yageo; Footprint_Description: Chip Resistor EIA 0603. METRIC 1608, 2-Leads, Body 1,6x0,8mm, IPC Medium Density; HelpURL: \\CORP1\RNDlibrary\_Library\Altium_lib\Datasheet\Yageo\RC0603\PYu-RC0603_51_RoHS_L_4.pdf; ComponentLink1Description: MANUFACTURER_URL; ComponentLink1URL: http://www.yageo.com/documents/recent/PYu-RC0603_51_RoHS_L_4.pdf; Price: 0,00600000005215406; TimeModification_Comp: 09.12.2011 8:18:44
U1-U5 U11-U15 U21 = TP4056: Complete single cell Li-Ion battery with a constant current / constant voltage linear charger; MF: NanJing Top Power ASIC Corp.; Check_prices: https://www.snapeda.com/parts/TP4056/NanJing+Top+Power+ASIC+Corp./view-part/?ref=eda; SnapEDA_Link: https://www.snapeda.com/parts/TP4056/NanJing+Top+Power+ASIC+Corp./view-part/?ref=snap; Price: None; Availability: Not in stock; Package: Package; MP: TP4056; Value: *
U6-U10 U16-U20 U23 = DW01A: One Cell Lithium-ion/Polymer Battery Protection IC; MF: Fortune Semiconductor; SnapEDA_Link: https://www.snapeda.com/parts/DW01A/Fortune+Semiconductor/view-part/?ref=snap; Package: SOT-23-6 Fortune Semiconductor; Value: *; MP: DW01A; Check_prices: https://www.snapeda.com/parts/DW01A/Fortune+Semiconductor/view-part/?ref=eda
U22 = MT3608: High Efficiency 1.2MHz2A Step Up Converter; MF: Aerosemi Technology Co., Ltd; Price: None; Availability: Not in stock; Package: Package; MP: MT3608; Value: *; SnapEDA_Link: https://www.snapeda.com/parts/MT3608/Aerosemi+Technology+Co.%252C+Ltd/view-part/?ref=snap; Check_prices: https://www.snapeda.com/parts/MT3608/Aerosemi+Technology+Co.%252C+Ltd/view-part/?ref=eda
U24 = ESP32-DEVKITC-32D: WiFi Development Tools (802.11) ESP32 General Development Kit, ESP32-WROOM-32D on the board; MF: Espressif Systems; SnapEDA_Link: https://www.snapeda.com/parts/ESP32-DEVKITC-32D/Espressif+Systems/view-part/?ref=snap; Package: None; Value: *; MP: ESP32-DEVKITC-32D; Check_prices: https://www.snapeda.com/parts/ESP32-DEVKITC-32D/Espressif+Systems/view-part/?ref=eda
X1-X10 = Charge Connector: Выводы под плату зарядки
X11-X13 = CON2: Коннектор двухконтактный; ManufacturerPartnumber: LP401230; Manufacturer: Robiton; BOM: Аккумулятор литий ионный    LP401230 Robiton; Human_Readable: Аккумулятор литий ионный; Footprint_Description: Custom